# EAGLE design PanelPCB (EAGLE 9.6.2)
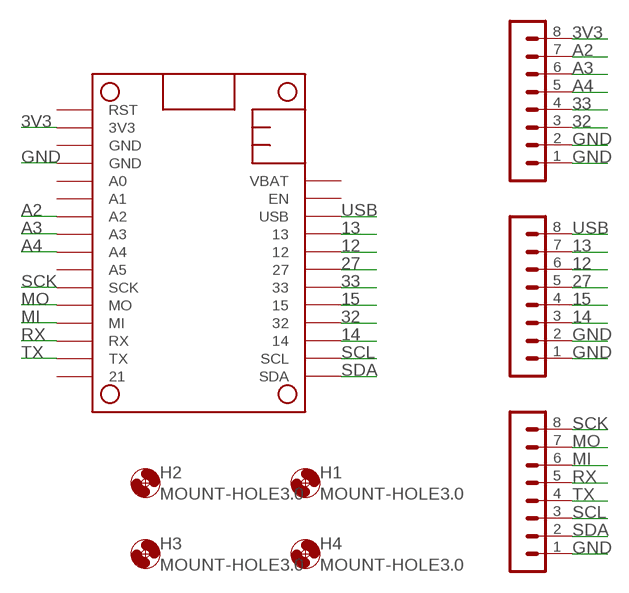
[diagram p0: schematic, sheet 1]

## Parts
H1  MOUNT-HOLE3.0  [3,0]
H2  MOUNT-HOLE3.0  [3,0]
H3  MOUNT-HOLE3.0  [3,0]
H4  MOUNT-HOLE3.0  [3,0]
M1  RARNDT-MISCELANEOUS_FEATHERBOARD_ESP32FETHERWING_DIM_ESP32  [RARNDT-MISCELANEOUS_FEATHERBOARD_ESP32]
SV1  MA08-1  [MA08-1]
SV2  MA08-1  [MA08-1]
SV3  MA08-1  [MA08-1]

## Nets
3V3: M1.2(3V3) SV1.8
12: M1.24 SV2.6
13: M1.25 SV2.7
14: M1.19 SV2.3
15: M1.21 SV2.4
27: M1.23 SV2.5
32: M1.20 SV1.3
33: M1.22 SV1.4
A2: M1.7(A2) SV1.7
A3: M1.8(A3) SV1.6
A4: M1.9(A4) SV1.5
GND: M1.4(GND) SV1.1 SV1.2 SV2.1 SV2.2 SV3.1
MI: M1.13(MI) SV3.6
MO: M1.12(MO) SV3.7
RX: M1.14(RX) SV3.5
SCK: M1.11(SCK) SV3.8
SCL: M1.18(SCL) SV3.3
SDA: M1.17(SDA) SV3.2
TX: M1.15(TX) SV3.4
USB: M1.26(USB) SV2.8
Unconnected: M1.1(RST) M1.3(GND) M1.5(A0) M1.6(A1) M1.10(A5) M1.16 M1.27(EN) M1.28(VBAT)

## Library data of the parts
H1-H4 = holes:MOUNT-HOLE: MOUNTING HOLE with drill center marker
M1 = StewartPlatform:RARNDT-MISCELANEOUS_FEATHERBOARD_ESP32
SV1-SV3 = con-lstb:MA08-1: PIN HEADER; OC_FARNELL: unknown; OC_NEWARK: unknown

## Board
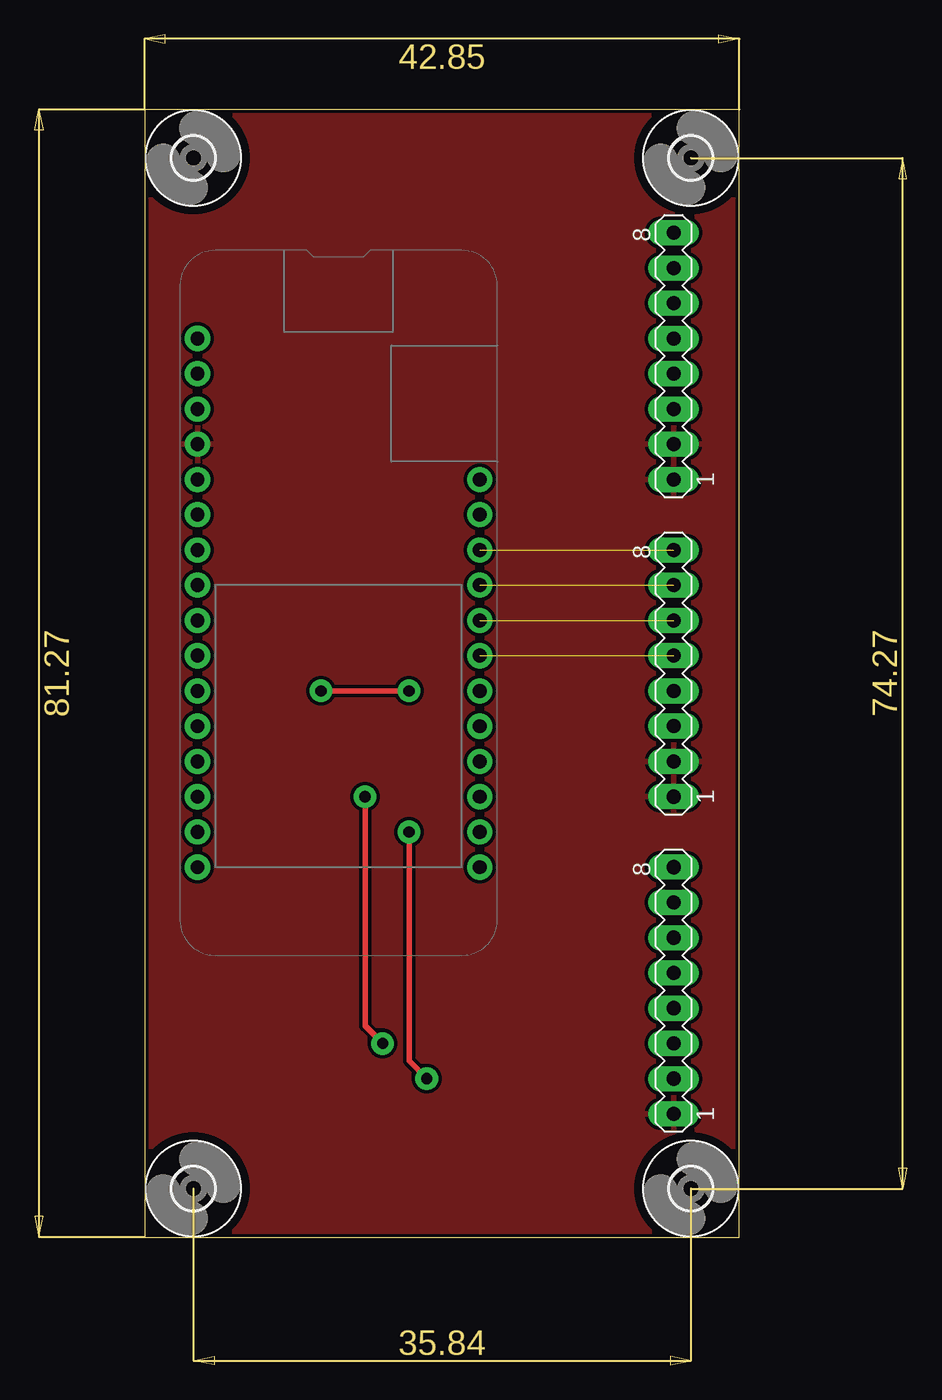
[diagram p1: board, top side]
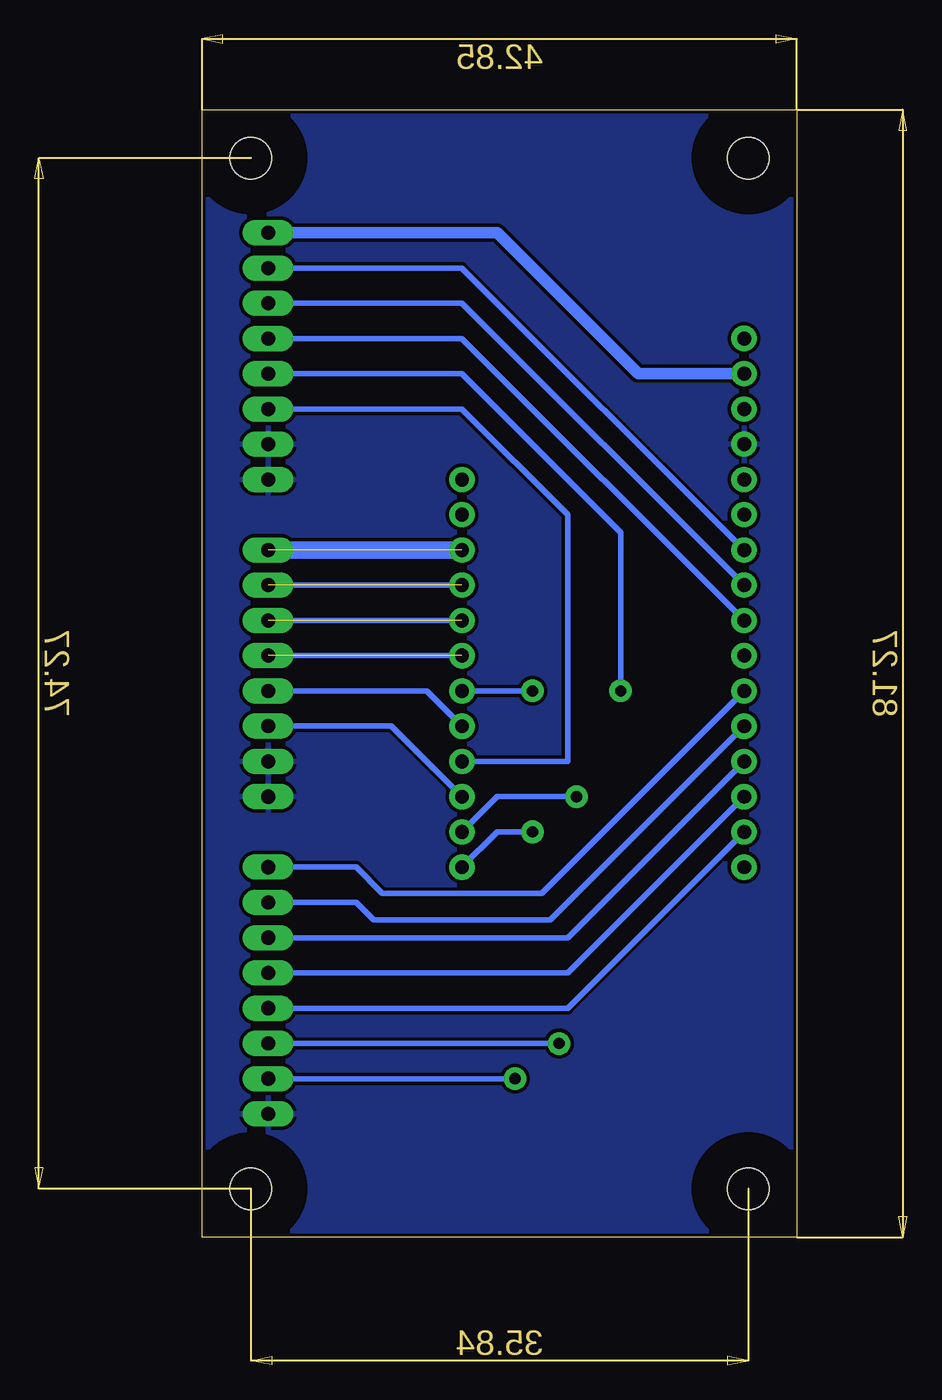
[diagram p2: board, bottom side, seen from below]

Size 42.85 x 81.27 mm. Coordinates in mm from the lower left corner, seen from the top.
Outline: 0,0 42.85,0 42.85,81.27 0,81.27 0,0
Copper layers (1*16): Top 0.035mm / dielectric 1.5mm / Bottom 0.035mm
Design rules "fablab_lpkf": minimum track width 16mil, minimum drill 32mil, track to track 10mil, track to pad 10mil, pad to pad 10mil, via to via 10mil, smd to smd 10mil, copper to edge 10mil, drill to drill 10mil, minimum pad ring 16mil, minimum via ring 16mil, stop-mask expansion 4mil, vias tented up to drill 0mil, thermal gap 10mil

### Footprints (pad centres in the part's own frame; a part is rotated, then mirrored left to right if it is on the bottom)
3,0 = hole 3: 0,0
RARNDT-MISCELANEOUS_FEATHERBOARD_ESP32 = drill 1: 1 -19.05,-10.16; 2 -16.51,-10.16; 3 -13.97,-10.16; 4 -11.43,-10.16; 5 -8.89,-10.16; 6 -6.35,-10.16; 7 -3.81,-10.16; 8 -1.27,-10.16; 9 1.27,-10.16; 10 3.81,-10.16; 11 6.35,-10.16; 12 8.89,-10.16; 13 11.43,-10.16; 14 13.97,-10.16; 15 16.51,-10.16; 16 19.05,-10.16; 17 19.05,10.16; 18 16.51,10.16; 19 13.97,10.16; 20 11.43,10.16; 21 8.89,10.16; 22 6.35,10.16; 23 3.81,10.16; 24 1.27,10.16; 25 -1.27,10.16; 26 -3.81,10.16; 27 -6.35,10.16; 28 -8.89,10.16
MA08-1 = drill 1.016 long: 1 -8.89,0; 2 -6.35,0; 3 -3.81,0; 4 -1.27,0; 5 1.27,0; 6 3.81,0; 7 6.35,0; 8 8.89,0

### Placement (x,y rotation side)
H1  3.51,3.51 0 top
H2  3.51,77.77 0 top
H3  39.34,3.51 0 top
H4  39.34,77.77 0 top
M1  13.97,45.72 270 top
SV1  38.1,63.5 90 top
SV2  38.1,40.64 90 top
SV3  38.1,17.78 90 top

### Tracks (layer width: path | path; a pad name or v marks a point on that pad's centre or on a via)
3V3
  Bottom 0.813: M1.2 11.43,62.23 21.59,72.39 SV1.8
12  (2 unrouted)
  Bottom 0.406: M1.24 SV2.6
13  (2 unrouted)
  Bottom 0.406: M1.25 SV2.7
14
  Bottom 0.406: M1.19 29.21,36.83 SV2.3
15
  Bottom 0.406: M1.21 26.67,39.37 SV2.4
27  (2 unrouted)
  Bottom 0.406: M1.23 SV2.5
32
  Bottom 0.406: M1.20 16.51,34.29 16.51,52.07 24.13,59.69 SV1.3
33  (via drill 0.81)
  Top 0.406: v19.05,39.37 v12.7,39.37
  Bottom 0.406: v12.7,39.37 12.7,50.8 24.13,62.23 SV1.4 | M1.22 v19.05,39.37
A2
  Bottom 0.406: M1.7 24.13,69.85 SV1.7
A3
  Bottom 0.406: M1.8 24.13,67.31 SV1.6
A4
  Bottom 0.406: M1.9 24.13,64.77 SV1.5
GND
  pour Top: -1.27,-1.27 -1.27,82.55 44.45,82.55 44.45,-1.27
  pour Bottom: -2.54,-2.54 -2.54,83.82 45.72,83.82 45.72,-2.54
MI
  Bottom 0.406: SV3.6 16.51,21.59 M1.13
MO
  Bottom 0.406: M1.12 17.78,22.86 30.48,22.86 31.75,24.13 SV3.7
RX
  Bottom 0.406: M1.14 16.51,19.05 SV3.5
SCK
  Bottom 0.406: SV3.8 31.75,26.67 29.87,24.79 18.39,24.79 M1.11
SCL  (via drill 0.81)
  Top 0.406: v15.88,31.75 15.88,15.24 v17.14,13.97
  Bottom 0.406: v17.14,13.97 SV3.3 | M1.18 21.59,31.75 v15.88,31.75
SDA  (via drill 0.81)
  Top 0.406: v19.05,29.21 19.05,12.7 v20.32,11.43
  Bottom 0.406: v20.32,11.43 SV3.2 | M1.17 21.59,29.21 v19.05,29.21
TX
  Bottom 0.406: M1.15 16.51,16.51 SV3.4
USB  (2 unrouted)
  Bottom 1.27: M1.26 SV2.8

### Text on the board
tDocu: 3V3 / A2 / A3 / A4 / 33 / 32 / GND / GND | USB / 13 / 12 / 27 / 15 / 14 / GND / GND | SCK / MO / MI / RX / TX / SCL / SDA / GND